# EAGLE design Main (EAGLE 9.3.1)
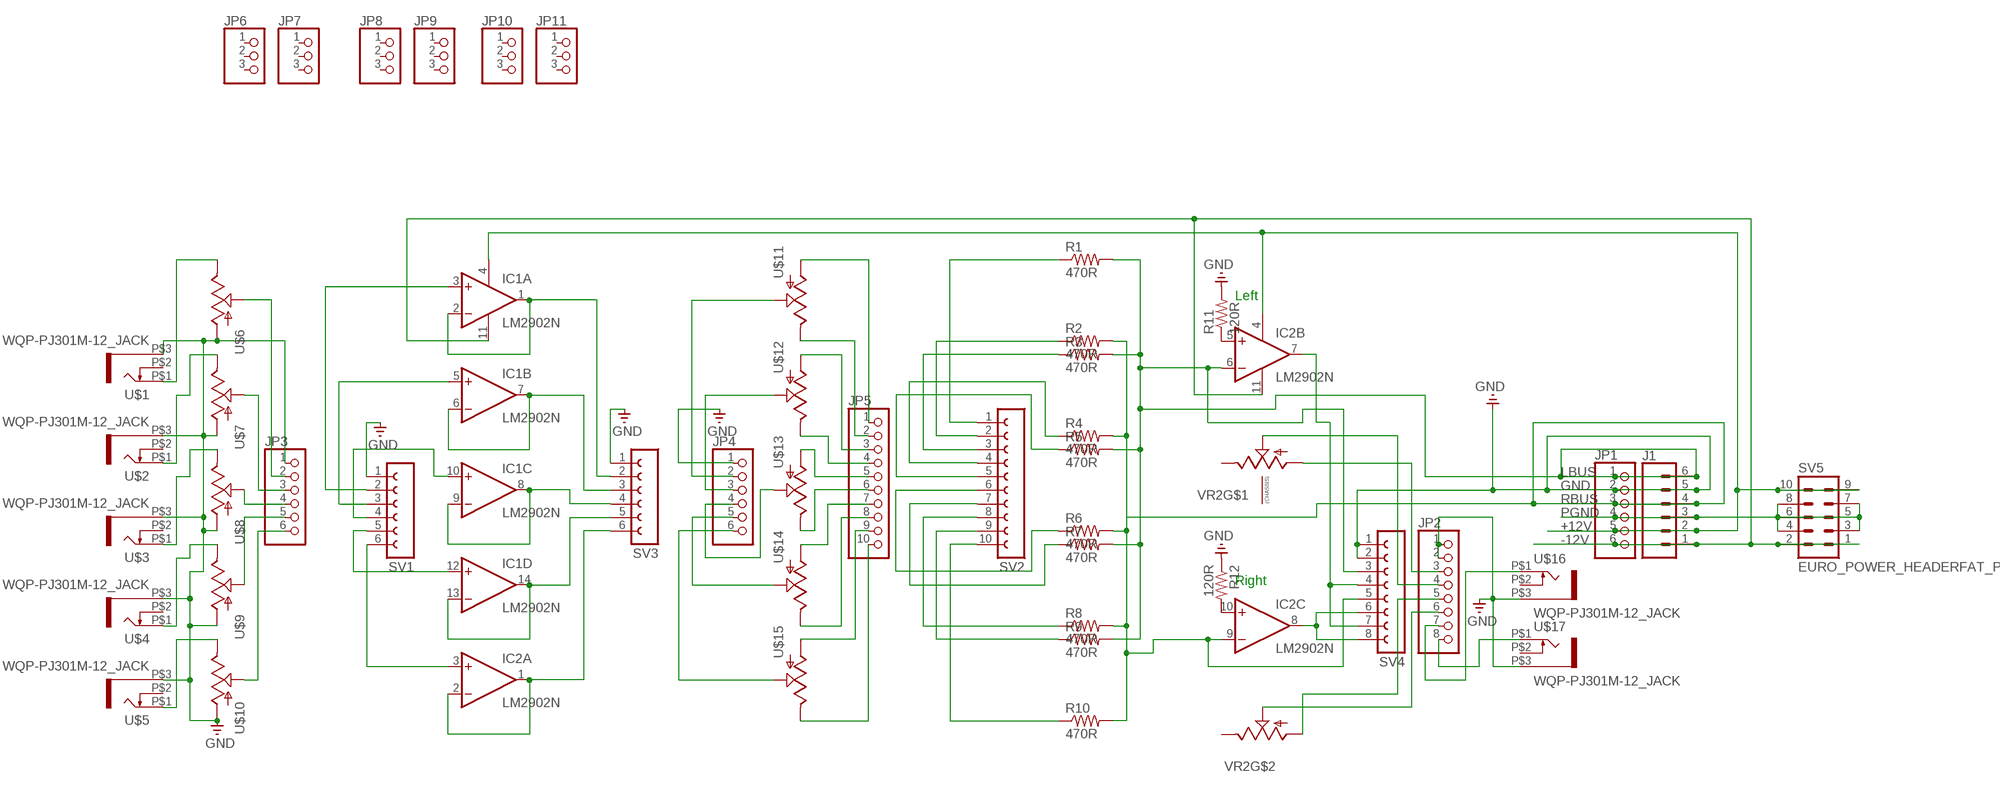
[diagram p0: schematic, sheet 1]

## Parts
IC1  LM2902N  [DIL14]
IC2  LM2902N  [DIL14]
J1  CONN_06SMD-FEMALE-V2  [1X06-SMD-FEMALE]
JP1  PINHD-1X6/90  [1X06/90]
JP2  PINHD-1X8  [1X08]
JP3  PINHD-1X6  [1X06]
JP4  PINHD-1X6  [1X06]
JP5  PINHD-1X10  [1X10]
JP6  PINHD-1X3  [1X03]
JP7  PINHD-1X3  [1X03]
JP8  PINHD-1X3  [1X03]
JP9  PINHD-1X3  [1X03]
JP10  PINHD-1X3  [1X03]
JP11  PINHD-1X3  [1X03]
R1  470R  R-US_0207/9  [0207/9]
R2  470R  R-US_0207/9  [0207/9]
R3  470R  R-US_0207/9  [0207/9]
R4  470R  R-US_0207/9  [0207/9]
R5  470R  R-US_0207/9  [0207/9]
R6  470R  R-US_0207/9  [0207/9]
R7  470R  R-US_0207/9  [0207/9]
R8  470R  R-US_0207/9  [0207/9]
R9  470R  R-US_0207/9  [0207/9]
R10  470R  R-US_0207/9  [0207/9]
R11  120R  R-US_0207/9  [0207/9]
R12  120R  R-US_0207/9  [0207/9]
SV1  FE06-1  [FE06]
SV2  FE10-1  [FE10]
SV3  FE06-1  [FE06]
SV4  FE08-1  [FE08]
SV5  EURO_POWER_HEADERFAT_PADS  [EURO_PWR_HEADER_FAT]
U$1  WQP-PJ301M-12_JACK  [WQP-PJ301M-12_JACK]
U$2  WQP-PJ301M-12_JACK  [WQP-PJ301M-12_JACK]
U$3  WQP-PJ301M-12_JACK  [WQP-PJ301M-12_JACK]
U$4  WQP-PJ301M-12_JACK  [WQP-PJ301M-12_JACK]
U$5  WQP-PJ301M-12_JACK  [WQP-PJ301M-12_JACK]
U$6  POT  [ALPS_POT]
U$7  POT  [ALPS_POT]
U$8  POT  [ALPS_POT]
U$9  POT  [ALPS_POT]
U$10  POT  [ALPS_POT]
U$11  POT  [ALPS_POT]
U$12  POT  [ALPS_POT]
U$13  POT  [ALPS_POT]
U$14  POT  [ALPS_POT]
U$15  POT  [ALPS_POT]
U$16  WQP-PJ301M-12_JACK  [WQP-PJ301M-12_JACK]
U$17  WQP-PJ301M-12_JACK  [WQP-PJ301M-12_JACK]
VR2  ALPHA-9MM-DUALPOT  [DUAL_9MM_SNAP-IN_POT]

## Nets
+12V: IC1.4(P:V+) IC2.4(P:V+) J1.2 JP1.5 SV5.9 SV5.10
-12V: IC1.11(P:V-) IC2.11(P:V-) J1.1 JP1.6 SV5.1 SV5.2
GND: J1.5 JP1.2 JP2.1 JP2.2 JP3.1 R11.2 R12.1 SV1.1 SV3.1 SV4.1 SV4.2 U$1.P$3 U$2.P$3 U$3.P$3 U$4.P$3 U$5.P$3 U$6.P$3(A) U$7.P$3(A) U$8.P$3(A) U$9.P$3(A) U$10.P$3(A) U$16.P$3 U$17.P$3
LBUS: IC2.6(B:-IN) J1.6 JP1.1 R1.2 R3.2 R5.2 R7.2 R9.2 SV4.3
N$1: U$1.P$1 U$6.P$1(E)
N$2: U$2.P$1 U$7.P$1(E)
N$3: U$3.P$1 U$8.P$1(E)
N$4: U$4.P$1 U$9.P$1(E)
N$5: U$5.P$1 U$10.P$1(E)
N$6: JP3.2 U$6.P$2(S)
N$7: JP3.3 U$7.P$2(S)
N$8: JP3.4 U$8.P$2(S)
N$9: JP3.5 U$9.P$2(S)
N$10: JP3.6 U$10.P$2(S)
N$11: IC1.1(A:OUT) IC1.2(A:-IN) SV3.2
N$12: IC1.6(B:-IN) IC1.7(B:OUT) SV3.3
N$13: IC1.8(C:OUT) IC1.9(C:-IN) SV3.4
N$14: IC1.13(D:-IN) IC1.14(D:OUT) SV3.5
N$15: IC2.1(A:OUT) IC2.2(A:-IN) SV3.6
N$16: JP5.1 U$11.P$3(A)
N$17: JP5.2 U$11.P$1(E)
N$18: JP5.3 U$12.P$3(A)
N$19: JP5.4 U$12.P$1(E)
N$20: JP5.5 U$13.P$3(A)
N$21: JP5.6 U$13.P$1(E)
N$22: JP5.7 U$14.P$3(A)
N$23: JP5.8 U$14.P$1(E)
N$24: JP5.9 U$15.P$3(A)
N$25: JP5.10 U$15.P$1(E)
N$26: JP2.8 U$17.P$1
N$27: IC1.10(C:+IN) SV1.4
N$28: IC2.5(B:+IN) R11.1
N$29: IC2.10(C:+IN) R12.2
N$30: IC2.7(B:OUT) SV4.4 SV4.7
N$31: IC1.5(B:+IN) SV1.3
N$32: IC2.3(A:+IN) SV1.6
N$33: IC1.3(A:+IN) SV1.2
N$34: IC1.12(D:+IN) SV1.5
N$35: R1.1 SV2.1
N$36: R2.1 SV2.2
N$37: R3.1 SV2.3
N$38: R4.1 SV2.4
N$39: R5.1 SV2.5
N$40: R10.1 SV2.10
N$41: R9.1 SV2.9
N$42: R8.1 SV2.8
N$43: R6.1 SV2.6
N$44: R7.1 SV2.7
N$45: JP4.4 U$13.P$2(S)
N$46: JP4.5 U$14.P$2(S)
N$47: JP4.6 U$15.P$2(S)
N$48: JP4.3 U$12.P$2(S)
N$49: JP4.2 U$11.P$2(S)
N$50: JP4.1 ; supply symbol labelled GND
N$51: JP2.6 VR2.2B(S)
N$52: JP2.7 U$16.P$1
N$53: JP2.5 VR2.1B(A)
N$54: JP2.4 VR2.2(S)
N$55: IC2.8(C:OUT) SV4.6 SV4.8
N$58: JP2.3 VR2.1(A)
PGND: J1.3 JP1.4 SV5.3 SV5.4 SV5.5 SV5.6 SV5.7 SV5.8
RBUS: IC2.9(C:-IN) J1.4 JP1.3 R2.2 R4.2 R6.2 R8.2 R10.2 SV4.5
Unconnected: IC2.12(D:+IN) IC2.13(D:-IN) IC2.14(D:OUT) JP6.1 JP6.2 JP6.3 JP7.1 JP7.2 JP7.3 JP8.1 JP8.2 JP8.3 JP9.1 JP9.2 JP9.3 JP10.1 JP10.2 JP10.3 JP11.1 JP11.2 JP11.3 U$1.P$2 U$2.P$2 U$3.P$2 U$4.P$2 U$5.P$2 U$16.P$2 U$17.P$2 VR2.3(E) VR2.3B(E) VR2.CHASSIS1 VR2.CHASSIS2

## Notes on the sheet
- Left
- Right

## Library data of the parts
IC1 = linear:LM2902: Low power quad operational amplifier Source: Data sgeet <http://www.st.com/internet/com/TECHNICAL_RESOURCES/TECHNICAL_LITERATURE/DATASHEET/CD00000533.pdf>; SPICEPREFIX: J
IC2 = linear:LM2902: Low power quad operational amplifier Source: Data sgeet <http://www.st.com/internet/com/TECHNICAL_RESOURCES/TECHNICAL_LITERATURE/DATASHEET/CD00000533.pdf>
J1 = SparkFun-Connectors:CONN_06: Multi connection point. Often used as Generic Header-pin footprint for 0.1 inch spaced/style header connections On any of the 0.1 inch spaced packages, you can populate with these: Break Away Headers - Straight <https://www.sparkfun.com/products/116> (PRT-00116) Break Away Male Headers - Right Angle <https://www.sparkfun.com/products/553> (PRT-00553) Female Headers <https://www.sparkfun.com/products/115> (PRT-00115) Break Away Headers - Machine Pin <https://www.sparkfun.com/products/117> (PRT-00117) Break Away Female Headers - Swiss Machine Pin <https://www.sparkfun.com/products/743> (PRT-00743) Arduino Stackable Header - 6 Pin <https://www.sparkfun.com/products/9280> (PRT-09280) For SCREWTERMINALS and SPRING TERMINALS visit here: Screw Terimnals on SparkFun.com <https://www.sparkfun.com/search/results?term=Screw+Terminals> (5mm/3.5mm/2.54mm spacing) This device is also useful as a general connection point to wire up your design to another part of your project. Our various solder wires solder well into these plated through hole pads. Hook-Up Wire - Assortment (Stranded, 22 AWG) <https://www.sparkfun.com/products/11375> (PRT-11375) Hook-Up Wire - Assortment (Solid Core, 22 AWG) <https://www.sparkfun.com/products/11367> (PRT-11367) View the entire wire category on our website here <https://www.sparkfun.com/categories/141>; PROD_ID: CONN-09668
JP1 JP3 JP4 = pinhead:PINHD-1X6: PIN HEADER
JP2 = pinhead:PINHD-1X8: PIN HEADER
JP5 = pinhead:PINHD-1X10: PIN HEADER
JP6-JP11 = pinhead:PINHD-1X3: PIN HEADER
R1-R12 = adafruit:R-US_: RESISTOR, American symbol
SV1 SV3 = con-lsta:FE06-1: FEMALE HEADER; OC_FARNELL: unknown; OC_NEWARK: unknown
SV2 = con-lsta:FE10-1: FEMALE HEADER; OC_FARNELL: unknown; OC_NEWARK: unknown
SV4 = con-lsta:FE08-1: FEMALE HEADER
SV5 = MusicThingModular:EURO_POWER_HEADER: Power Header 10 pin power header for Eurorack Power Supplies Variants with fatter pads for easier soldering, and the LOCK variant which has 5mil offset pins to hold the component in place before soldering
U$1-U$5 U$16 U$17 = thonkiconn:WQP-PJ301M-12_JACK
U$6-U$15 = SparkFun:POT
VR2 = MusicThingModular:ALPHA-9MM-DUALPOT: 9mm vertical snap-in pot, Alpha / Panasonic style, with a connection to the metal chassis for grounding

## Board
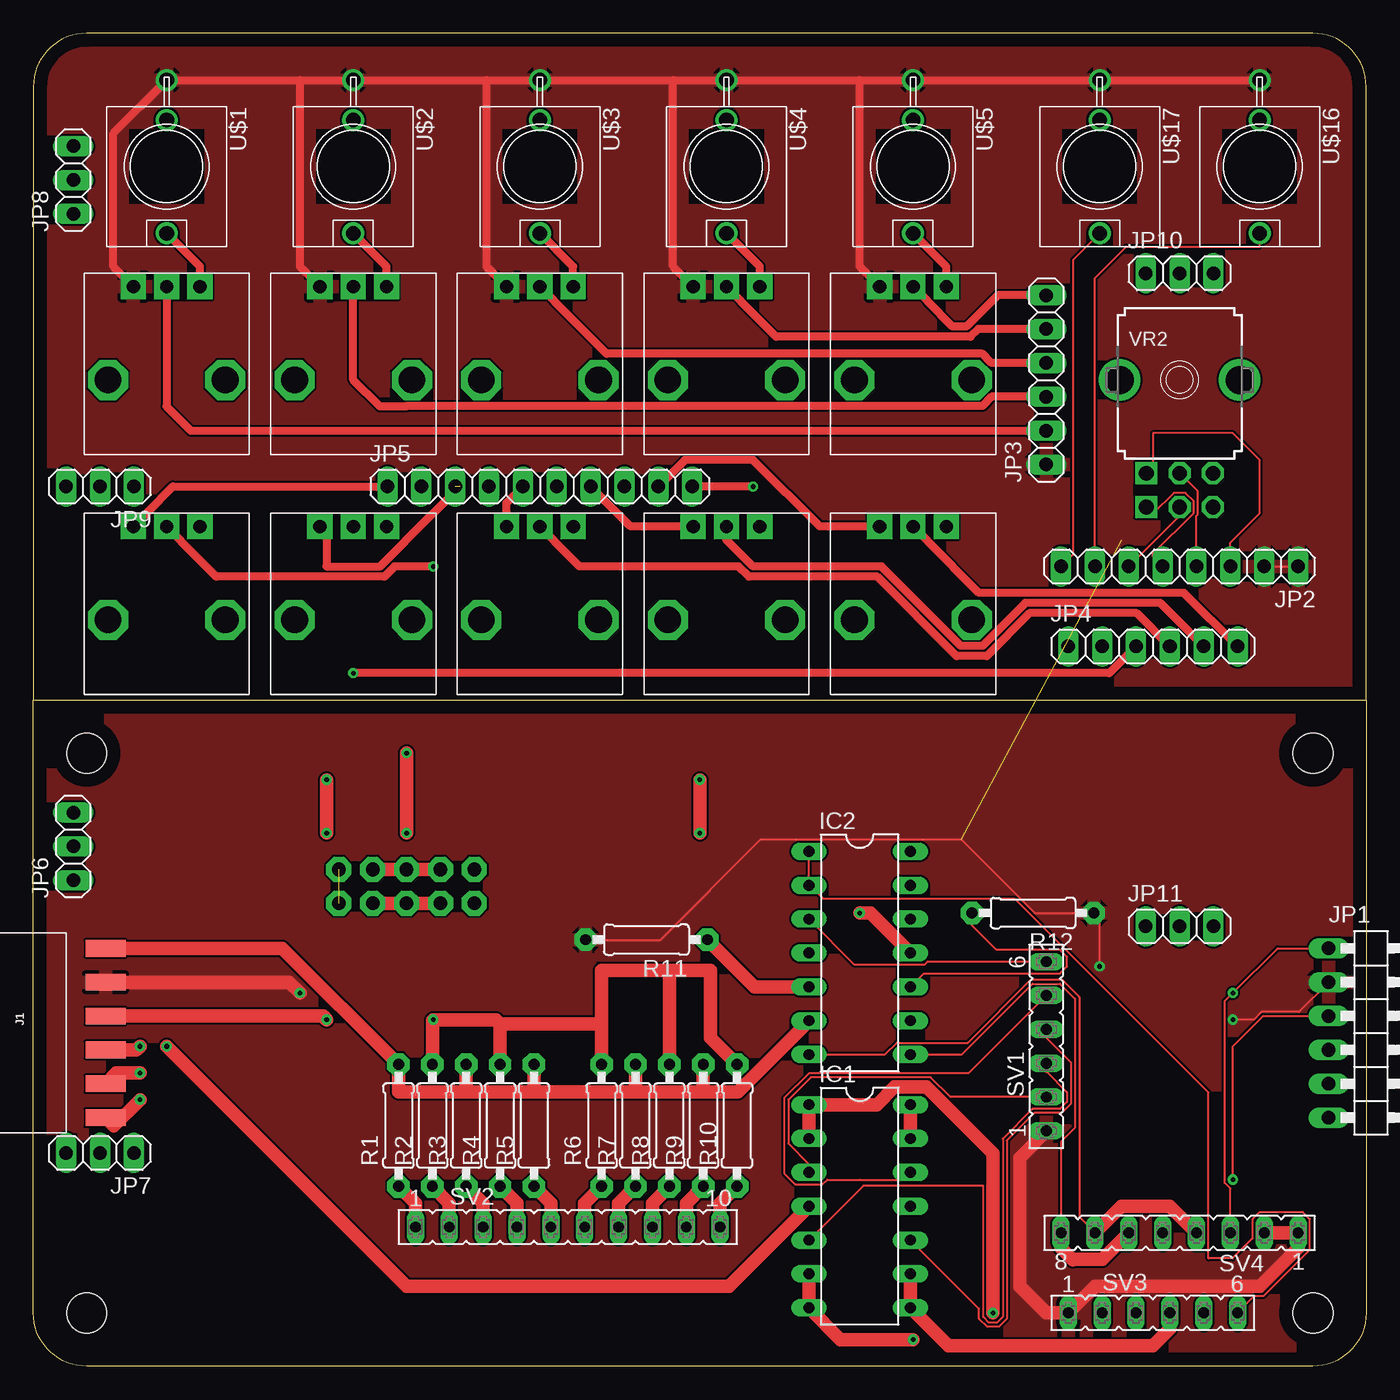
[diagram p1: board, top side]
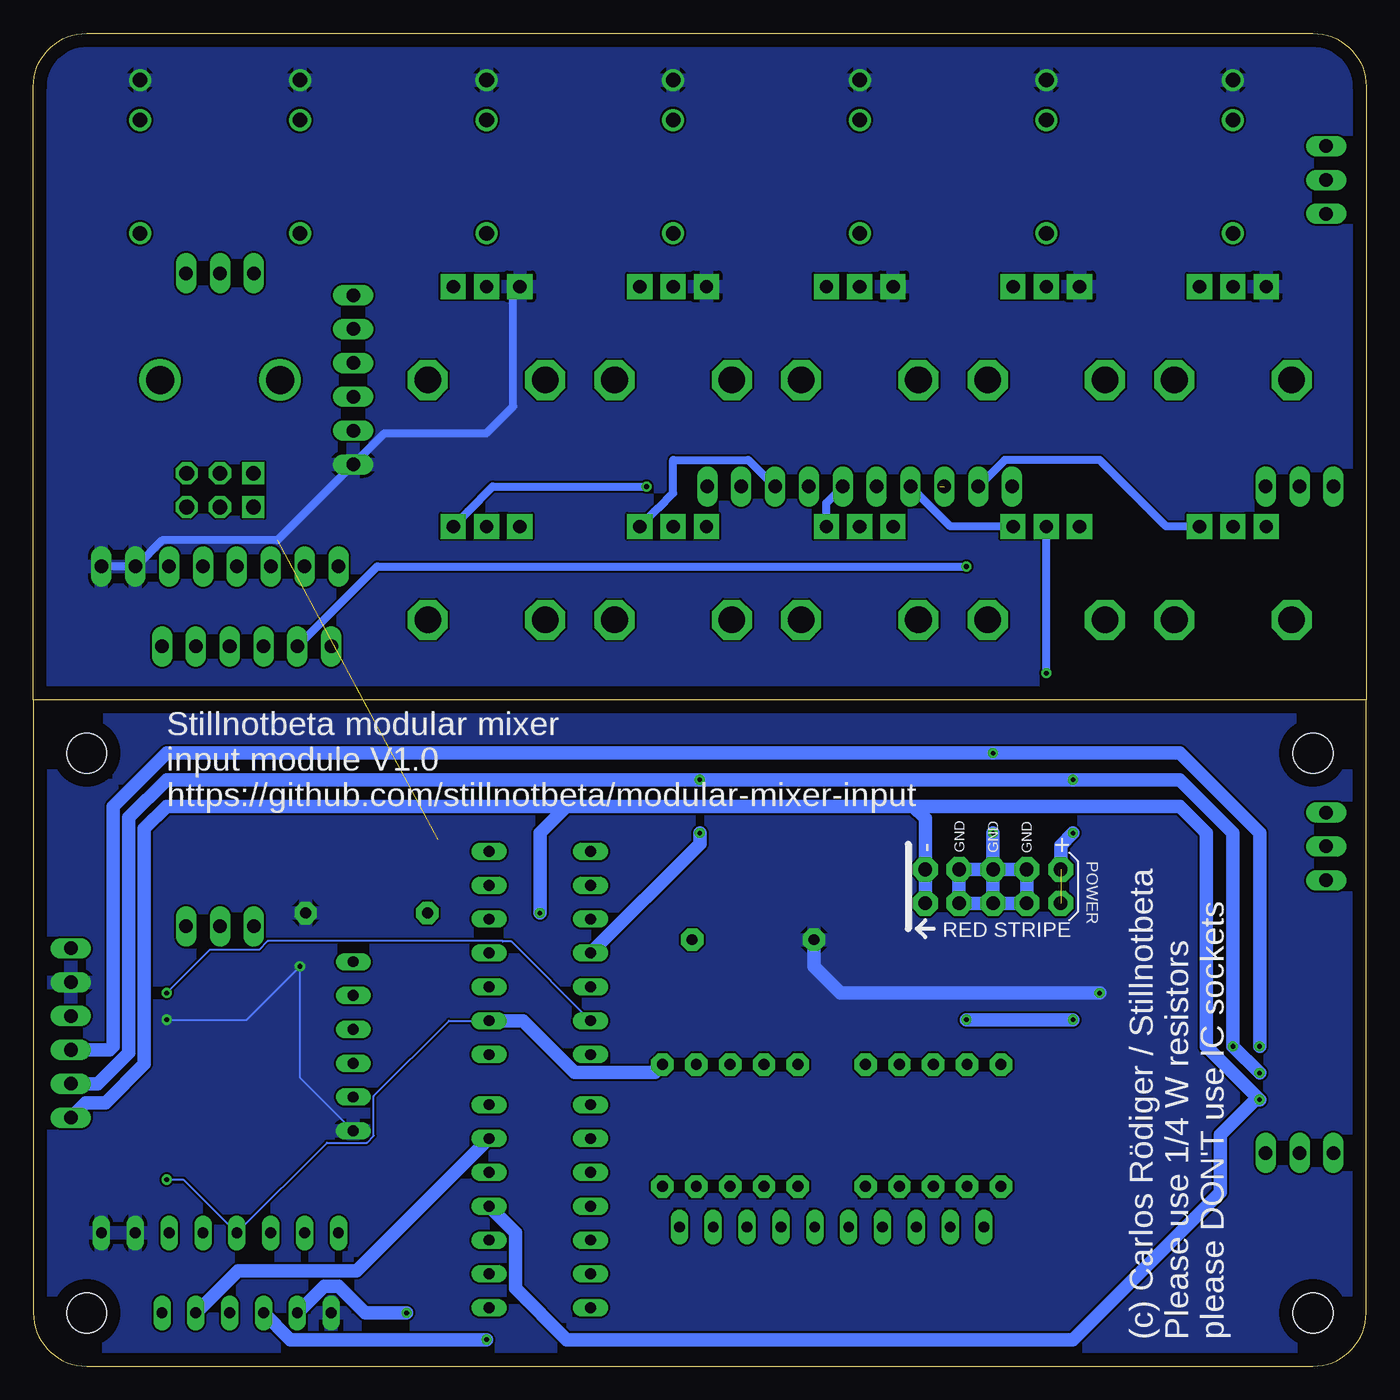
[diagram p2: board, bottom side, seen from below]

Size 100 x 100 mm. Coordinates in mm from the lower left corner, seen from the top.
Outline: 100,50 100,96 arc90 96,100 4,100 arc90 0,96 0,50
Outline: 0,50 100,50
Outline: 100,50 100,4 arc-90 96,0 4,0 arc-90 0,4 0,50
Copper layers (1*16): Top 0.035mm / dielectric 1.5mm / Bottom 0.035mm
Design rules "default": minimum track width 6mil, minimum drill 0.35mm, track to track 6mil, track to pad 6mil, pad to pad 6mil, via to via 6mil, smd to smd 6mil, copper to edge 40mil, drill to drill 6mil, minimum pad ring 10mil, minimum via ring 8mil, stop-mask expansion 4mil, vias tented up to drill 0mil, thermal gap 10mil
Holes 3 mm at 4,46 96,46 96,4 4,4

### Footprints (pad centres in the part's own frame; a part is rotated, then mirrored left to right if it is on the bottom)
DIL14 = drill 0.813 long: 1 -7.62,-3.81; 2 -5.08,-3.81; 3 -2.54,-3.81; 4 0,-3.81; 5 2.54,-3.81; 6 5.08,-3.81; 7 7.62,-3.81; 8 7.62,3.81; 9 5.08,3.81; 10 2.54,3.81; 11 0,3.81; 12 -2.54,3.81; 13 -5.08,3.81; 14 -7.62,3.81
1X06-SMD-FEMALE = smd 1.25 x 3: 1 6.35,3.425; 2 3.81,3.425; 3 1.27,3.425; 4 -1.27,3.425; 5 -3.81,3.425; 6 -6.35,3.425
1X06/90 = drill 1.016 long: 1 -6.35,-3.81; 2 -3.81,-3.81; 3 -1.27,-3.81; 4 1.27,-3.81; 5 3.81,-3.81; 6 6.35,-3.81
1X08 = drill 1.016 long: 1 -8.89,0; 2 -6.35,0; 3 -3.81,0; 4 -1.27,0; 5 1.27,0; 6 3.81,0; 7 6.35,0; 8 8.89,0
1X06 = drill 1.016 long: 1 -6.35,0; 2 -3.81,0; 3 -1.27,0; 4 1.27,0; 5 3.81,0; 6 6.35,0
1X10 = drill 1.016 long: 1 -11.43,0; 2 -8.89,0; 3 -6.35,0; 4 -3.81,0; 5 -1.27,0; 6 1.27,0; 7 3.81,0; 8 6.35,0; 9 8.89,0; 10 11.43,0
1X03 = drill 1.016 long: 1 -2.54,0; 2 0,0; 3 2.54,0
0207/9 = drill 0.813 pad 1.676 octagon: 1 -4.572,0; 2 4.572,0
FE06 = drill 0.813 long: 1 -6.35,0; 2 -3.81,0; 3 -1.27,0; 4 1.27,0; 5 3.81,0; 6 6.35,0
FE10 = drill 0.813 long: 1 -11.43,0; 2 -8.89,0; 3 -6.35,0; 4 -3.81,0; 5 -1.27,0; 6 1.27,0; 7 3.81,0; 8 6.35,0; 9 8.89,0; 10 11.43,0
FE08 = drill 0.813 long: 1 -8.89,0; 2 -6.35,0; 3 -3.81,0; 4 -1.27,0; 5 1.27,0; 6 3.81,0; 7 6.35,0; 8 8.89,0
EURO_PWR_HEADER_FAT = drill 1.016 pad 1.88 octagon: 1 -5.08,-1.27; 2 -5.08,1.27; 3 -2.54,-1.27; 4 -2.54,1.27; 5 0,-1.27; 6 0,1.27; 7 2.54,-1.27; 8 2.54,1.27; 9 5.08,-1.27; 10 5.08,1.27
WQP-PJ301M-12_JACK = drill 1.1: P$1 0,5; P$2 0,-3.5; P$3 0,-6.5
ALPS_POT = drill 1 pad 1.88 square: P$1 7,-2.5; P$2 7,0; P$3 7,2.5 | drill 2 octagon: P$4 0,-4.4; P$5 0,4.4
DUAL_9MM_SNAP-IN_POT = drill 1.1 square: 1 -2.5,-7; 1B -2.5,-9.54 | drill 1.1 octagon: 2 0,-7; 2B 0,-9.54; 3 2.5,-7; 3B 2.5,-9.54 | drill 2.1 pad 2.54: CHASSIS1 -4.5,0; CHASSIS2 4.5,0

### Placement (x,y rotation side)
IC1  62,12 270 top
IC2  62,31 270 top
J1  2,25 270 top
JP1  101,25 270 top
JP2  86,60 180 top
JP3  76,74 90 top
JP4  84,54 0 top
JP5  38,66 0 top
JP6  3,39 90 top
JP7  5,16 180 top
JP8  3,89 90 top
JP9  5,66 180 top
JP10  86,82 0 top
JP11  86,33 0 top
R1  27.4,18.06 90 top
R2  29.94,18.06 90 top
R3  32.48,18.06 90 top
R4  35.02,18.06 90 top
R5  37.56,18.06 90 top
R6  42.64,18.06 90 top
R7  45.18,18.06 90 top
R8  47.72,18.06 90 top
R9  50.26,18.06 90 top
R10  52.8,18.06 90 top
R11  46,32 180 top
R12  75,34 180 top
SV1  76,24 90 top
SV2  40.1,10.44 0 top
SV3  84,4 0 top
SV4  86,10 180 top
SV5  28,36 0 bottom
U$1  10,90 180 top
U$2  24,90 180 top
U$3  38,90 180 top
U$4  52,90 180 top
U$5  66,90 180 top
U$6  10,74 90 top
U$7  24,74 90 top
U$8  38,74 90 top
U$9  52,74 90 top
U$10  66,74 90 top
U$11  10,56 90 top
U$12  24,56 90 top
U$13  38,56 90 top
U$14  52,56 90 top
U$15  66,56 90 top
U$16  92,90 180 top
U$17  80,90 180 top
VR2  86,74 0 top

### Tracks (layer width: path | path; a pad name or v marks a point on that pad's centre or on a via)
+12V  (via drill 0.35)  (1 unrouted)
  Top 1.016: J1.2 6.24,22 v8,22 | v50,40 v50,44 | v10,24 28,6 52.19,6 IC1.4 | v22,40 v22,44
  Bottom 1.016: v8,22 v10,24 10,40 14,44 v22,44 v50,44 90,44 92.83,41.17 92.83,23.52 95.16,21.19 JP1.5 | IC2.4 50,39.19 v50,40 | SV5.10 22.92,39.08 v22,40
-12V  (via drill 0.35)
  Top 1.016: J1.1 6.04,18.04 v8,20 | IC2.11 62.81,34 v62,34
  Bottom 1.016: 34,42 14,42 12,40 12,24 v8,20 8.31,20 10.96,17.35 10.96,13.04 22,2 60,2 63.83,5.83 63.83,10.01 65.81,11.99 IC1.11 | 34,42 60,42 | 60,42 90,42 91.66,40.34 91.66,22.68 94.58,19.77 96.07,19.77 JP1.6 | v62,34 62,40 60,42 | SV5.1 SV5.2 33.08,41.08 34,42
GND  (via drill 0.35)  (1 unrouted)
  Top 0.152: JP2.2 JP2.1 | v80,30 80,33.57 R12.1 75.13,34 69.62,39.51 54.57,39.51 47.06,32 R11.2 | JP1.2 94.95,26.57 92.14,26.57 91.57,26 v90,26
  Top 0.61: 20,96.5 U$1.P$3 6,92.5 6,82.5 U$6.P$3 | 20,96.5 34,96.5 | 34,96.5 48,96.5 | 48,96.5 62,96.5 | 62,96.5 U$16.P$3 | U$7.P$3 20,82.5 20,96.5 | U$8.P$3 34,82.5 34,96.5 | U$9.P$3 48,82.5 48,96.5 | U$10.P$3 62,82.5 62,96.5
  Top 1.016: SV1.1 74,15.65 74,6 76,4 SV3.1 79.65,6 92,6 94.89,8.89 SV4.1 SV4.2 | J1.5 19.19,28.81 v20,28
  Bottom 0.152: SV1.1 80,21.65 v80,30 84,26 v90,26
  Bottom 0.61: JP2.1 92.3,60 90.31,61.98 81.67,61.98 JP3.1 73.65,70 66,70 64,72 64,80.5 U$10.P$3
  Bottom 1.016: R11.2 41.43,30 39.43,28 v20,28
  pour Bottom: 0,54 0,96 arc-90 4,100 96,100 arc-90 100,96 100,54 arc-90 96,50 4,50 arc-90
  pour Bottom: 0,4 0,46 arc-90 4,50 96,50 arc-90 100,46 100,4 arc-90 96,0 4,0 arc-90
  pour Top: 0,54 0,96 arc-90 4,100 96,100 arc-90 100,96 100,54 arc-90 96,50 4,50 arc-90
  pour Top: 0,4 0,46 arc-90 4,50 96,50 arc-90 100,46 100,4 arc-90 96,0 4,0 arc-90
LBUS  (via drill 0.35)
  Top 0.152: JP1.1 93.35,31.35 v90,28 89.39,27.39 89.39,13.75 89.81,13.33 SV4.3
  Top 1.016: 32.48,20.6 27.4,20.6 R1.2 18.68,31.35 J1.6 | 32.48,20.6 37.56,20.6 | 37.56,20.6 45.18,20.6 | 45.18,20.6 50.26,20.6 | 50.26,20.6 R9.2 | R7.2 45.18,20.6 | R5.2 37.56,20.6 | R3.2 32.48,20.6 | IC2.6 52.87,20.6 50.26,20.6
  Bottom 0.152: IC2.6 64.14,31.86 | 64.14,31.86 64.16,31.89 | 64.14,31.86 64.76,31.86 64.78,31.89 82.41,31.89 83.05,31.25 86.75,31.25 v90,28
N$1
  Top 0.61: U$6.P$1 12.5,82.5 U$1.P$1
N$2
  Top 0.61: U$7.P$1 26.5,82.5 U$2.P$1
N$3
  Top 0.61: U$8.P$1 40.5,82.5 U$3.P$1
N$4
  Top 0.61: U$9.P$1 54.5,82.5 U$4.P$1
N$5
  Top 0.61: U$10.P$1 68.5,82.5 U$5.P$1
N$6
  Top 0.61: U$6.P$2 10,72 11.81,70.19 JP3.2
N$7
  Top 0.61: JP3.3 71.9,72.73 71.21,72.04 28.04,72.04 28,72 26,72 24,74 U$7.P$2
N$8
  Top 0.61: JP3.4 71.9,75.27 71.21,75.96 43.02,75.96 39.1,79.87 39.1,79.9 U$8.P$2
N$9
  Top 0.61: JP3.5 70.89,77.81 70.32,77.24 55.74,77.24 53.1,79.87 53.1,79.9 U$9.P$2
N$10
  Top 0.61: JP3.6 72.35,80.35 70,78 68.97,78 67.1,79.87 67.1,79.9 U$10.P$2
N$11  (via drill 0.35)
  Top 1.016: IC1.2 IC1.1 63.28,19.62 64.6,20.94 67.02,20.94 72,15.96 v72,4
  Bottom 1.016: v72,4 75.12,4 77.1,5.98 78.2,5.98 80.18,4 SV3.2
N$12  (via drill 0.35)
  Top 1.016: IC1.6 IC1.7 60.57,2 v66,2
  Bottom 1.016: v66,2 80.73,2 SV3.3
N$13
  Top 1.016: IC1.9 IC1.8 68.67,1.52 84,1.52 85.27,2.79 SV3.4
N$14
  Top 1.016: IC1.13 IC1.14
  Bottom 1.016: IC1.13 75.74,7.15 84.65,7.15 87.8,4 SV3.5
N$15
  Top 0.152: IC2.1 IC2.2 58.27,36.08 59.28,35.07 73.63,35.07 88.16,20.54 88.16,8.08 89.96,8.08 91.46,9.58 91.46,11.03 91.98,11.55 95.26,11.55 95.78,11.03 95.78,8.74 92.31,5.26 91.61,5.26 SV3.6
N$16
  Top 0.61: U$11.P$3 8.6,64.1 8.6,64.13 10.47,66 JP5.1
N$17
  Bottom 0.61: U$11.P$1 15,63 20,68 27.11,68 JP5.2
N$18  (1 unrouted)
  Top 0.61: U$12.P$3 22,62.5 22,60 26.03,60 27.9,61.87 27.9,61.9 32,66
N$19
  Bottom 0.61: U$12.P$1 31.19,63 JP5.4
N$20
  Top 0.61: U$13.P$3 35.5,64.77 JP5.5
N$21
  Bottom 0.61: U$13.P$1 40.5,64.77 JP5.6
N$22
  Top 0.61: U$14.P$3 44.81,63 JP5.7
N$23
  Bottom 0.61: U$14.P$1 53.4,64.1 53.4,64.13 53.13,64.4 53.1,64.4 52,65.5 52,68 46.35,68 JP5.8
N$24
  Top 0.61: U$15.P$3 59,63 54,68 48.89,68 JP5.9
N$25  (via drill 0.35)
  Top 0.61: v54,66 JP5.10
  Bottom 0.61: U$15.P$1 67.4,64.1 67.4,64.13 65.53,66 v54,66
N$26
  Top 0.152: U$17.P$1 78,83 78,60.89 JP2.8
N$27
  Top 0.152: IC1.10 70.96,4.31 70.96,3.57 71.57,2.96 72.43,2.96 73.04,3.57 73.04,16.94 75.1,19 77.16,19 77.85,19.7 77.85,22.79 76,24.65 SV1.4
N$28
  Top 1.016: R11.1 54.11,28.46 IC2.5
N$29
  Top 0.152: R12.2 70.43,33.08 72.27,31.24 77.03,31.24 77.55,30.72 77.55,29.98 77.03,29.46 66.81,29.46 IC2.10
N$30
  Top 0.152: 79.66,10 78.46,11.2 78.46,27.7 77.16,29 74.84,29 70.11,24.27 64.78,24.27 63.89,23.38 IC2.7
  Top 1.016: SV4.4 87.26,10 85.28,11.98 81.64,11.98 79.66,10 SV4.7
N$31
  Top 0.152: SV1.3 76,22.08 76.03,22.08 77.55,20.56 77.55,19.82 77.03,19.3 74.97,19.3 72.74,17.07 72.74,3.7 72.31,3.26 71.69,3.26 71.26,3.7 71.26,13.54 62.27,13.54 IC1.5
N$32
  Top 0.152: SV1.6 67.08,30.35 66.84,30.11 61.62,30.11 IC2.3
N$33
  Top 0.152: SV1.2 68.81,20.19 67.32,21.68 58.33,21.68 56.64,19.99 56.64,16.71 58.19,15.16 IC1.3
N$34
  Top 0.152: SV1.5 70.17,21.98 58.2,21.98 56.34,20.11 56.34,14.48 57.16,13.65 59.22,13.65 59.57,14 62,14 65.27,14 IC1.12
N$35
  Top 1.016: SV2.1 28.67,12.22 R1.1
N$36
  Top 1.016: SV2.2 31.21,12.22 R2.1
N$37
  Top 1.016: SV2.3 33.75,12.22 R3.1
N$38
  Top 1.016: SV2.4 36.29,12.22 R4.1
N$39
  Top 1.016: SV2.5 38.83,12.22 R5.1
N$40
  Top 1.016: SV2.10 51.53,12.22 R10.1
N$41
  Top 1.016: SV2.9 48.99,12.22 R9.1
N$42
  Top 1.016: SV2.8 46.45,12.22 R8.1
N$43
  Top 1.016: SV2.6 41.37,12.22 R6.1
N$44
  Top 1.016: SV2.7 43.91,12.22 R7.1
N$45
  Top 0.61: JP4.4 82.78,56.49 74.74,56.49 71.53,53.28 69.27,53.28 63.32,59.24 53.68,59.24 52.92,60 40.97,60 39.1,61.87 39.1,61.9 U$13.P$2
N$46
  Top 0.61: JP4.5 84.55,57.26 74.42,57.26 71.21,54.04 69.59,54.04 63.63,60 54,60 52,62 U$14.P$2
N$47
  Top 0.61: JP4.6 86.33,58.02 70.95,58.02 67.1,61.87 67.1,61.9 U$15.P$2
N$48  (via drill 0.35)
  Top 0.61: JP4.3 80.73,52 v24,52
  Bottom 0.61: v24,52 U$12.P$2
N$49  (via drill 0.35)
  Top 0.61: v30,60 27.1,60 26.34,59.24 13.74,59.24 11.1,61.87 11.1,61.9 U$11.P$2
  Bottom 0.61: JP4.2 74.19,60 v30,60
N$51
  Top 0.152: JP2.6 86,63.81 VR2.2B
N$52
  Top 0.152: JP2.7 79.65,81.65 82,84 92,84 U$16.P$1
N$53
  Top 0.152: JP2.5 84,60.73 84,60.97 87.05,64.02 87.05,64.9 86.44,65.51 85.56,65.51 84.05,64 83.96,64 VR2.1B
N$54
  Top 0.152: JP2.4 87.27,63.81 87.36,63.9 87.36,65.64 VR2.2
N$55
  Top 0.152: IC2.8 69.65,23.38 74.97,28.7 77.03,28.7 78.16,27.57 78.16,17.89 77.11,16.84 SV4.8
  Top 1.016: SV4.8 77.11,8.89 78,8 78.02,8.02 80.2,8.02 82.18,10 SV4.6
N$58
  Top 0.152: JP2.3 89.81,61.81 92,64 92,68 90,70 84,70 84,67.5 VR2.1
PGND  (via drill 0.35)
  Top 1.016: J1.3 7.73,23.73 v8,24 | v28,40 v28,46 | SV5.7 SV5.5 SV5.3 | SV5.8 SV5.6 SV5.4
  Bottom 1.016: v8,24 8,40 14,46 v28,46 90,46 94,42 94,24 94.27,23.73 JP1.4 | SV5.6 SV5.8 SV5.7 SV5.3 SV5.4 SV5.6 | SV5.6 v28,40 | SV5.5 SV5.6
RBUS  (via drill 0.35)
  Top 0.152: v90,14 90,24 92.27,26.27 JP1.3
  Top 1.016: 35.02,25.68 42.64,25.68 | 47.72,29.68 42.64,29.68 42.64,25.68 | 47.72,29.68 50.8,29.68 50.8,24.63 R10.2 | R8.2 47.72,29.68 | R6.2 42.64,25.68 | R4.2 35.02,25.68 | J1.4 21.73,26.27 v22,26 | 35.02,25.68 34.7,26 v30,26 29.94,25.94 R2.2
  Bottom 0.152: IC2.9 68.81,25.92 74.45,20.28 74.45,17.28 74.97,16.76 77.97,16.76 SV4.5 88.73,14 v90,14
  Bottom 1.016: IC2.9 63.26,25.92 59.4,22.06 53.37,22.06 R10.2 | v30,26 v22,26

### Text on the board
_bsilk: Stillnotbeta modular mixer / input module V1.0 / https://github.com/stillnotbeta/modular-mixer-input | (c) Carlos Rödiger / Stillnotbeta / Please use 1/4 W resistors / please DON'T use IC sockets